# Altium schematic sheet Sheet1.SchDoc
size A3; SheetNumber: 1; SheetTotal: 2
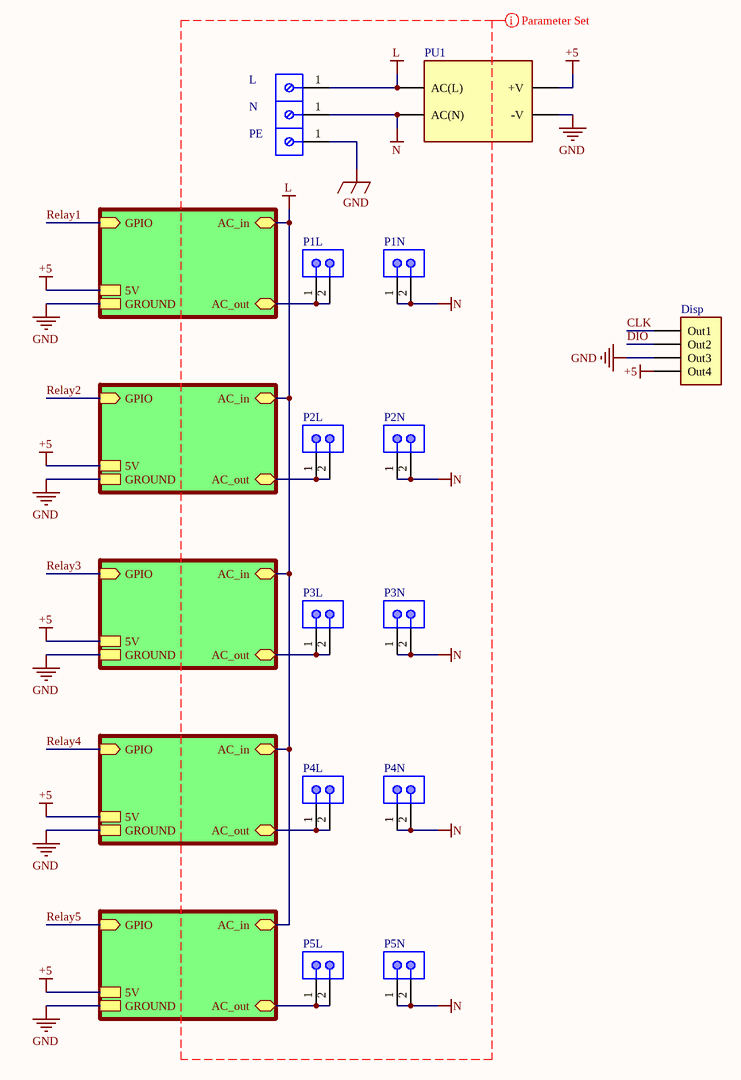
[diagram p0: Sheet1.SchDoc]

## Parts
Disp  4Pin Connector  [4Pin Connector]  (value not drawn)
L  691102810001  [691102810001]  (value not drawn)
N  691102810001  [691102810001]  (value not drawn)
P1L  1287-ST  [KSTN-1287-ST]  (value not drawn)
P1N  1287-ST  [KSTN-1287-ST]  (value not drawn)
P2L  1287-ST  [KSTN-1287-ST]  (value not drawn)
P2N  1287-ST  [KSTN-1287-ST]  (value not drawn)
P3L  1287-ST  [KSTN-1287-ST]  (value not drawn)
P3N  1287-ST  [KSTN-1287-ST]  (value not drawn)
P4L  1287-ST  [KSTN-1287-ST]  (value not drawn)
P4N  1287-ST  [KSTN-1287-ST]  (value not drawn)
P5L  1287-ST  [KSTN-1287-ST]  (value not drawn)
P5N  1287-ST  [KSTN-1287-ST]  (value not drawn)
PE  691102810001  [691102810001]  (value not drawn)
PU1  Netzteil  [Netzteil]  (value not drawn)

## Sub-sheets
U_Relay = Relay.SchDoc: AC_in (bidir), AC_out (bidir), GROUND, GPIO (in), 5V
U_Relay = Relay.SchDoc: AC_in (bidir), AC_out (bidir), GROUND, GPIO (in), 5V
U_Relay = Relay.SchDoc: AC_in (bidir), AC_out (bidir), GROUND, GPIO (in), 5V
U_Relay = Relay.SchDoc: AC_in (bidir), AC_out (bidir), GROUND, GPIO (in), 5V
U_Relay = Relay.SchDoc: AC_in (bidir), AC_out (bidir), GROUND, GPIO (in), 5V

## Nets
+5: Disp.4(Out4) PU1.VPOS(+V) ; sheet U_Relay/5V, sheet U_Relay/5V, sheet U_Relay/5V, sheet U_Relay/5V, sheet U_Relay/5V
GND: Disp.3(Out3) PE.1 PU1.VNEG(-V) ; sheet U_Relay/GROUND, sheet U_Relay/GROUND, sheet U_Relay/GROUND, sheet U_Relay/GROUND, sheet U_Relay/GROUND
L: L.1 PU1.AC/L(AC(L)) ; sheet U_Relay/AC_in, sheet U_Relay/AC_in, sheet U_Relay/AC_in, sheet U_Relay/AC_in, sheet U_Relay/AC_in
N: N.1 P1N.1 P1N.2 P2N.1 P2N.2 P3N.1 P3N.2 P4N.1 P4N.2 P5N.1 P5N.2 PU1.AC/N(AC(N))
CLK: Disp.1(Out1)
DIO: Disp.2(Out2)
Relay1: sheet U_Relay/GPIO
Relay2: sheet U_Relay/GPIO
Relay3: sheet U_Relay/GPIO
Relay4: sheet U_Relay/GPIO
Relay5: sheet U_Relay/GPIO
NetP1L_1: P1L.1 P1L.2 ; sheet U_Relay/AC_out
NetP2L_1: P2L.1 P2L.2 ; sheet U_Relay/AC_out
NetP3L_1: P3L.1 P3L.2 ; sheet U_Relay/AC_out
NetP4L_1: P4L.1 P4L.2 ; sheet U_Relay/AC_out
NetP5L_1: P5L.1 P5L.2 ; sheet U_Relay/AC_out

## Layout directives
net class HV: GND, L, N

## Library data of the parts
L N PE = CMP-03913-134028450-1: 691102810001 Pitch mm = 10 / Wire Connection Method = Screw / Poles = 1 / PCB Mounting Method = THT / Wire Size AWG Max. AWG = 22...; NexarPartId: 134028450
P1L P1N P2L P2N P3L P3N P4L P4N P5L P5N = CMP-2000-05485-1: PC Sturdi-Mount Quick-Fit Terminal, Vertical, Male, 2-Pin THD, Bulk; Manufacturer: Keystone; Angle: Straight; Insulation Type: Non-Insulated; Material, Contact: Brass; Tab Fit: 0.25; Finish Plating: TinPlate; Mounting Hole Size: 0.052; Finish: Tin; Primary Type: QuickDisconnect; Standards: ULListed; Contact Plating: Tin; Datasheet Version: Rev. C, 08/2012; Package URL: http://www.keyelco.com/product-pdf.cfm?p=1859; Length, Overall: 0.552"; Terminal Style: PCBMale; Mounting: VERTICAL; Gender: Male; Package Description: 2-Leads Quick-Fit Terminal, Pitch 5.08 mm; Type: Tab; Manufacturer URL: http://www.keyelco.com/; Terminal Type: Quick-Fit; Orientation: VERTICAL-Sturdi-Mount; Material: .032[.81]Brass; Diameter, Hole: 0.052in.; Mounting Technology: ThroughHole; Datasheet URL: http://www.keyelco.com/product-pdf.cfm?p=1859; Width, Overall: 0.312"; Termination: Solder; Package Reference: 1287-ST; Mount Angle: Straight
PU1 = Netzteil: IRM-05-5